# EAGLE design 01 (EAGLE 6.3)
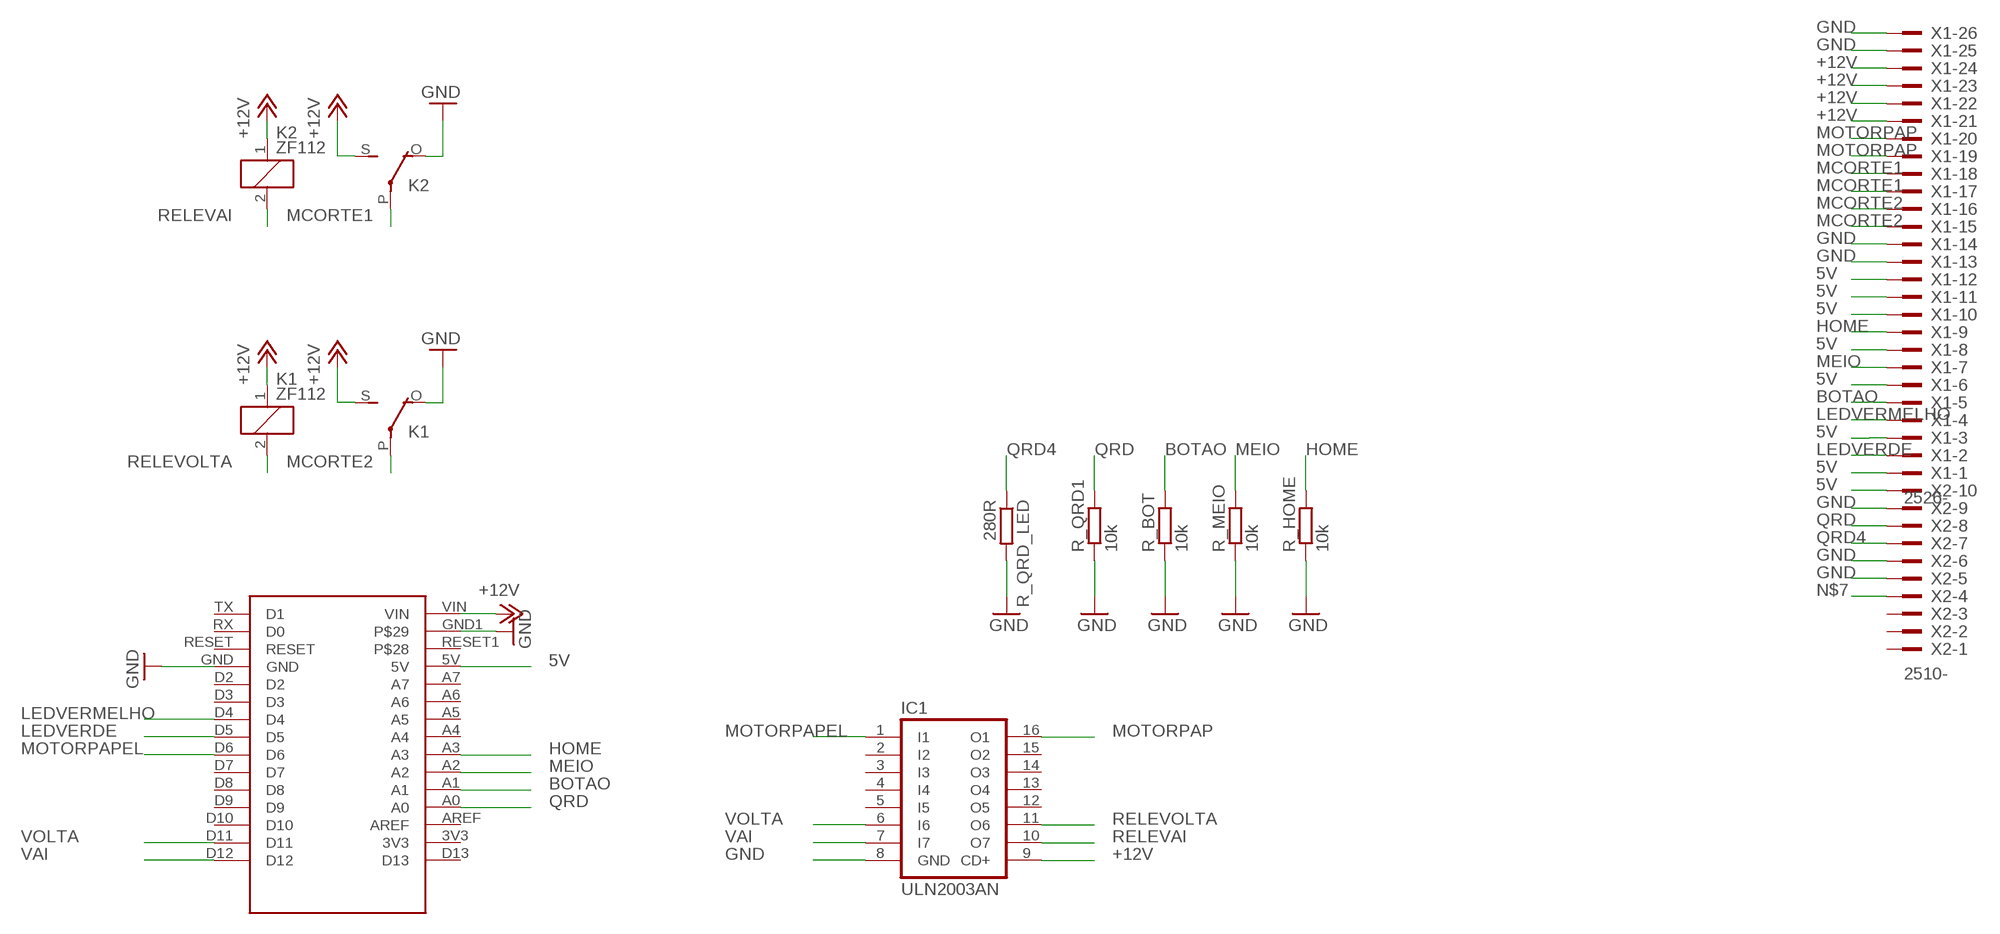
[diagram p0: schematic, sheet 1]

## Parts
IC1  ULN2003AN  [DIL16]
K1  ZF112  [ZF112]
K2  ZF112  [ZF112]
R_BOT  10k  R-EU_0207/15  [0207/15]
R_HOME  10k  R-EU_0207/15  [0207/15]
R_MEIO  10k  R-EU_0207/15  [0207/15]
R_QRD1  10k  R-EU_0207/15  [0207/15]
R_QRD_LED  280R  R-EU_0204/7  [0204/7]
U$1  ARDUINONANO  [NANO]
X1  2526-  [PAK100/2500-26]
X2  2510-  [PAK100/2500-10]

## Nets
5V: U$1.5V X1.1 X1.3 X1.6 X1.8 X1.10 X1.11 X1.12 X2.10
+12V: IC1.9(CD+) K1.1 K1.S(2:S) K2.1 K2.S(2:S) U$1.VIN X1.21 X1.22 X1.23 X1.24
BOTAO: R_BOT.2 U$1.A1 X1.5
GND: IC1.8(GND) K1.O(2:O) K2.O(2:O) R_BOT.1 R_HOME.1 R_MEIO.1 R_QRD1.1 R_QRD_LED.2 U$1.GND U$1.GND1 X1.13 X1.14 X1.25 X1.26 X2.5 X2.6 X2.9
HOME: R_HOME.2 U$1.A3 X1.9
LEDVERDE: U$1.D5 X1.2
LEDVERMELHO: U$1.D4 X1.4
MCORTE1: K2.P(2:P) X1.17 X1.18
MCORTE2: K1.P(2:P) X1.15 X1.16
MEIO: R_MEIO.2 U$1.A2 X1.7
MOTORPAP: IC1.16(O1) X1.19 X1.20
MOTORPAPEL: IC1.1(I1) U$1.D6
N$7: X2.4
QRD: R_QRD1.2 U$1.A0 X2.8
QRD4: R_QRD_LED.1 X2.7
RELEVAI: IC1.10(O7) K2.2
RELEVOLTA: IC1.11(O6) K1.2
VAI: IC1.7(I7) U$1.D12
VOLTA: IC1.6(I6) U$1.D11
Unconnected: IC1.2(I2) IC1.3(I3) IC1.4(I4) IC1.5(I5) IC1.12(O5) IC1.13(O4) IC1.14(O3) IC1.15(O2) U$1.3V3 U$1.A4 U$1.A5 U$1.A6 U$1.A7 U$1.AREF U$1.D2 U$1.D3 U$1.D7 U$1.D8 U$1.D9 U$1.D10 U$1.D13 U$1.RESET U$1.RESET1 U$1.RX(D0) U$1.TX(D1) X2.1 X2.2 X2.3

## Library data of the parts
IC1 = uln-udn:ULN2003A: DRIVER ARRAY
K1 K2 = relay:ZF112: RELAY 1 x switch; OC_FARNELL: unknown; OC_NEWARK: unknown
R_BOT R_HOME R_MEIO R_QRD1 R_QRD_LED = rcl:R-EU_: RESISTOR, European symbol
U$1 = arduino:ARDUINONANO
X1 = con-3m:2526-: 3M (TM) Pak 100 4-Wall Header Source: 3M; OC_FARNELL: unknown; OC_NEWARK: unknown
X2 = con-3m:2510-: 3M (TM) Pak 100 4-Wall Header Source: 3M; MF: 3M; MPN: 2510-6002UB; OC_FARNELL: 9838244; OC_NEWARK: 46F4725

## Board
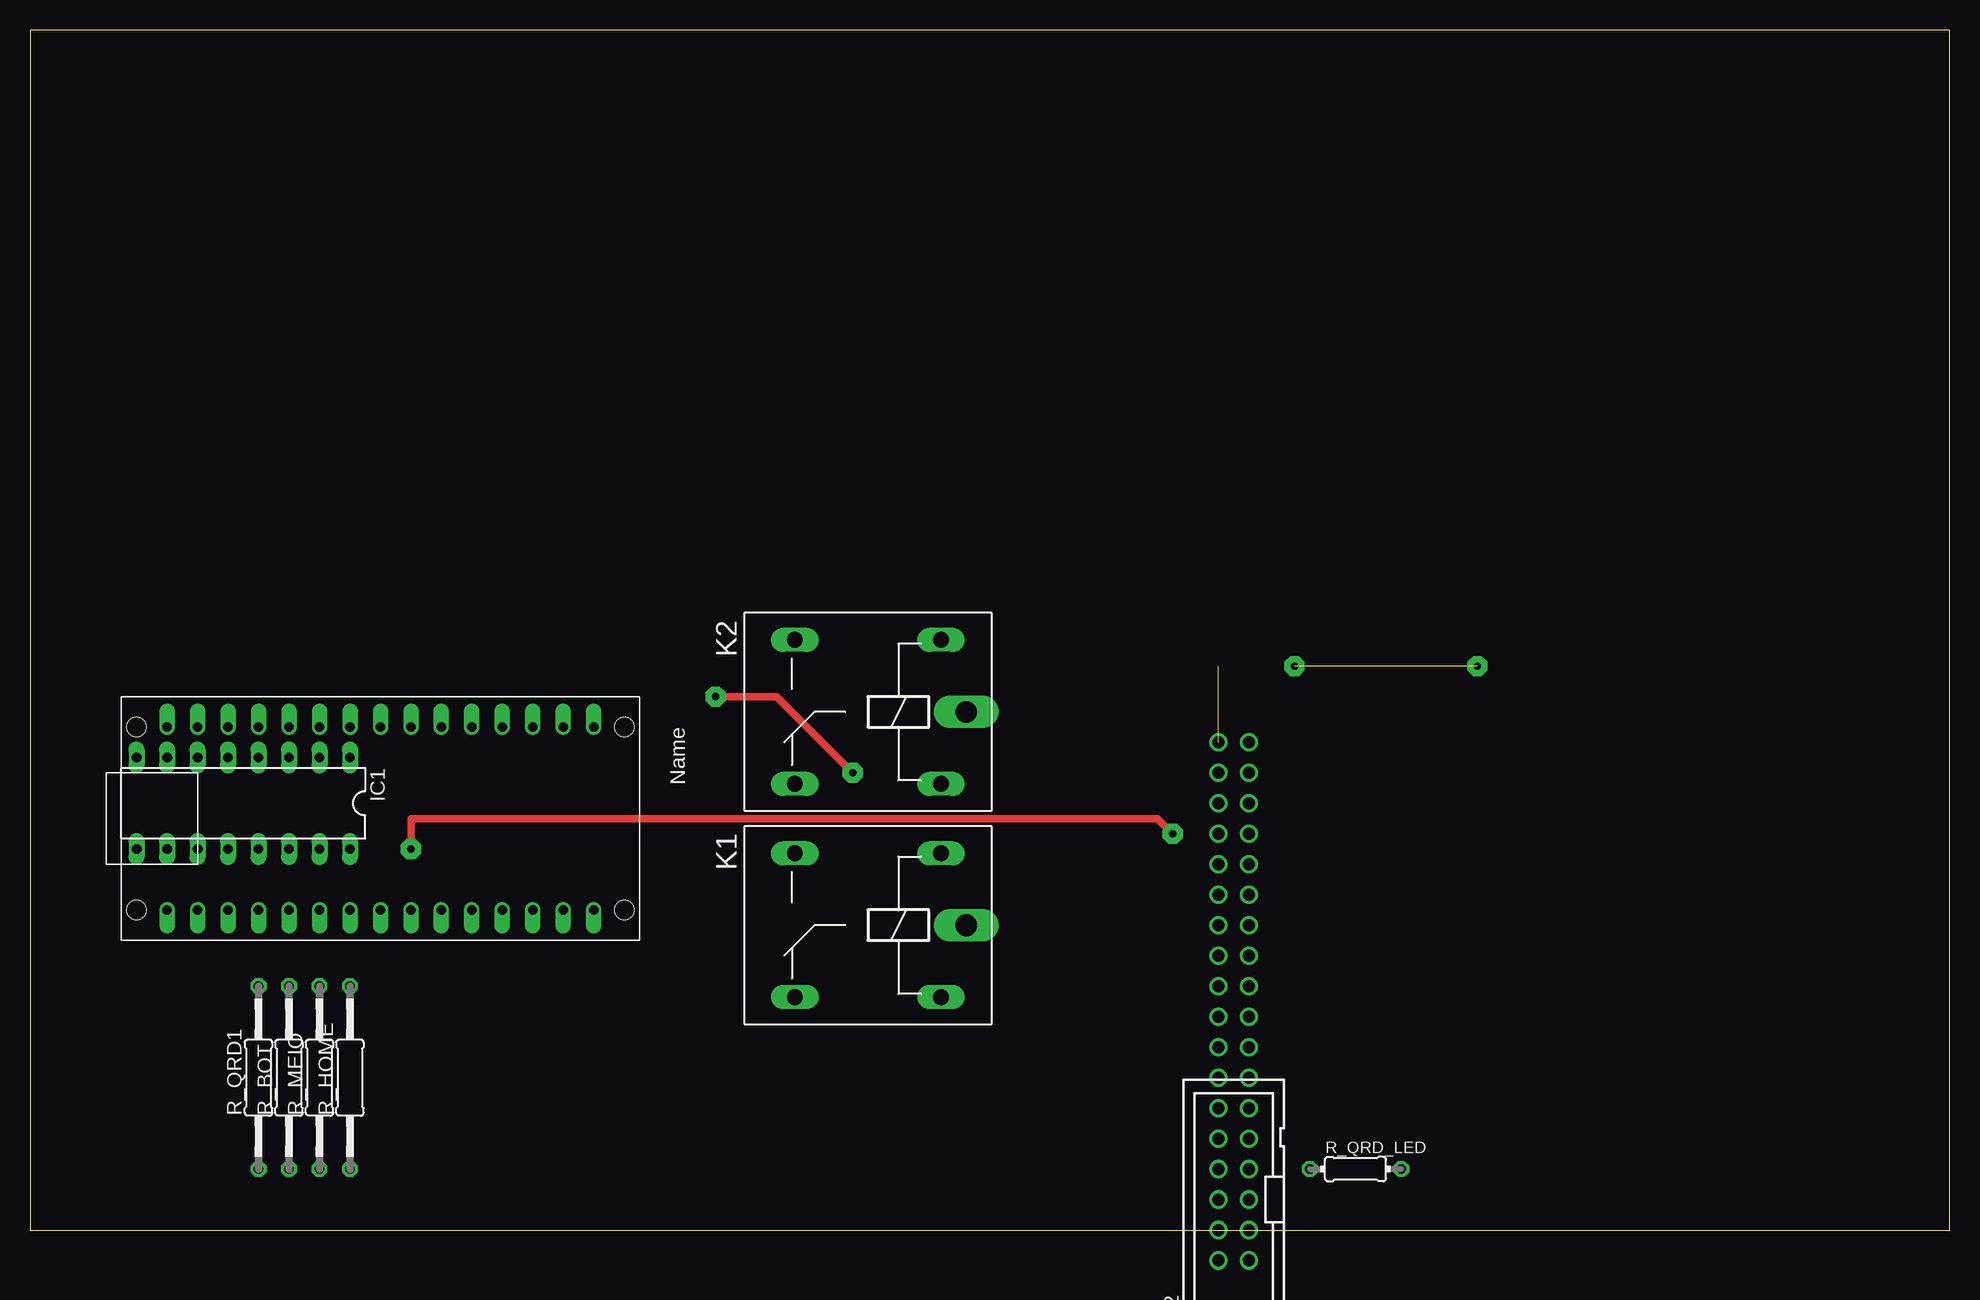
[diagram p1: board, top side]
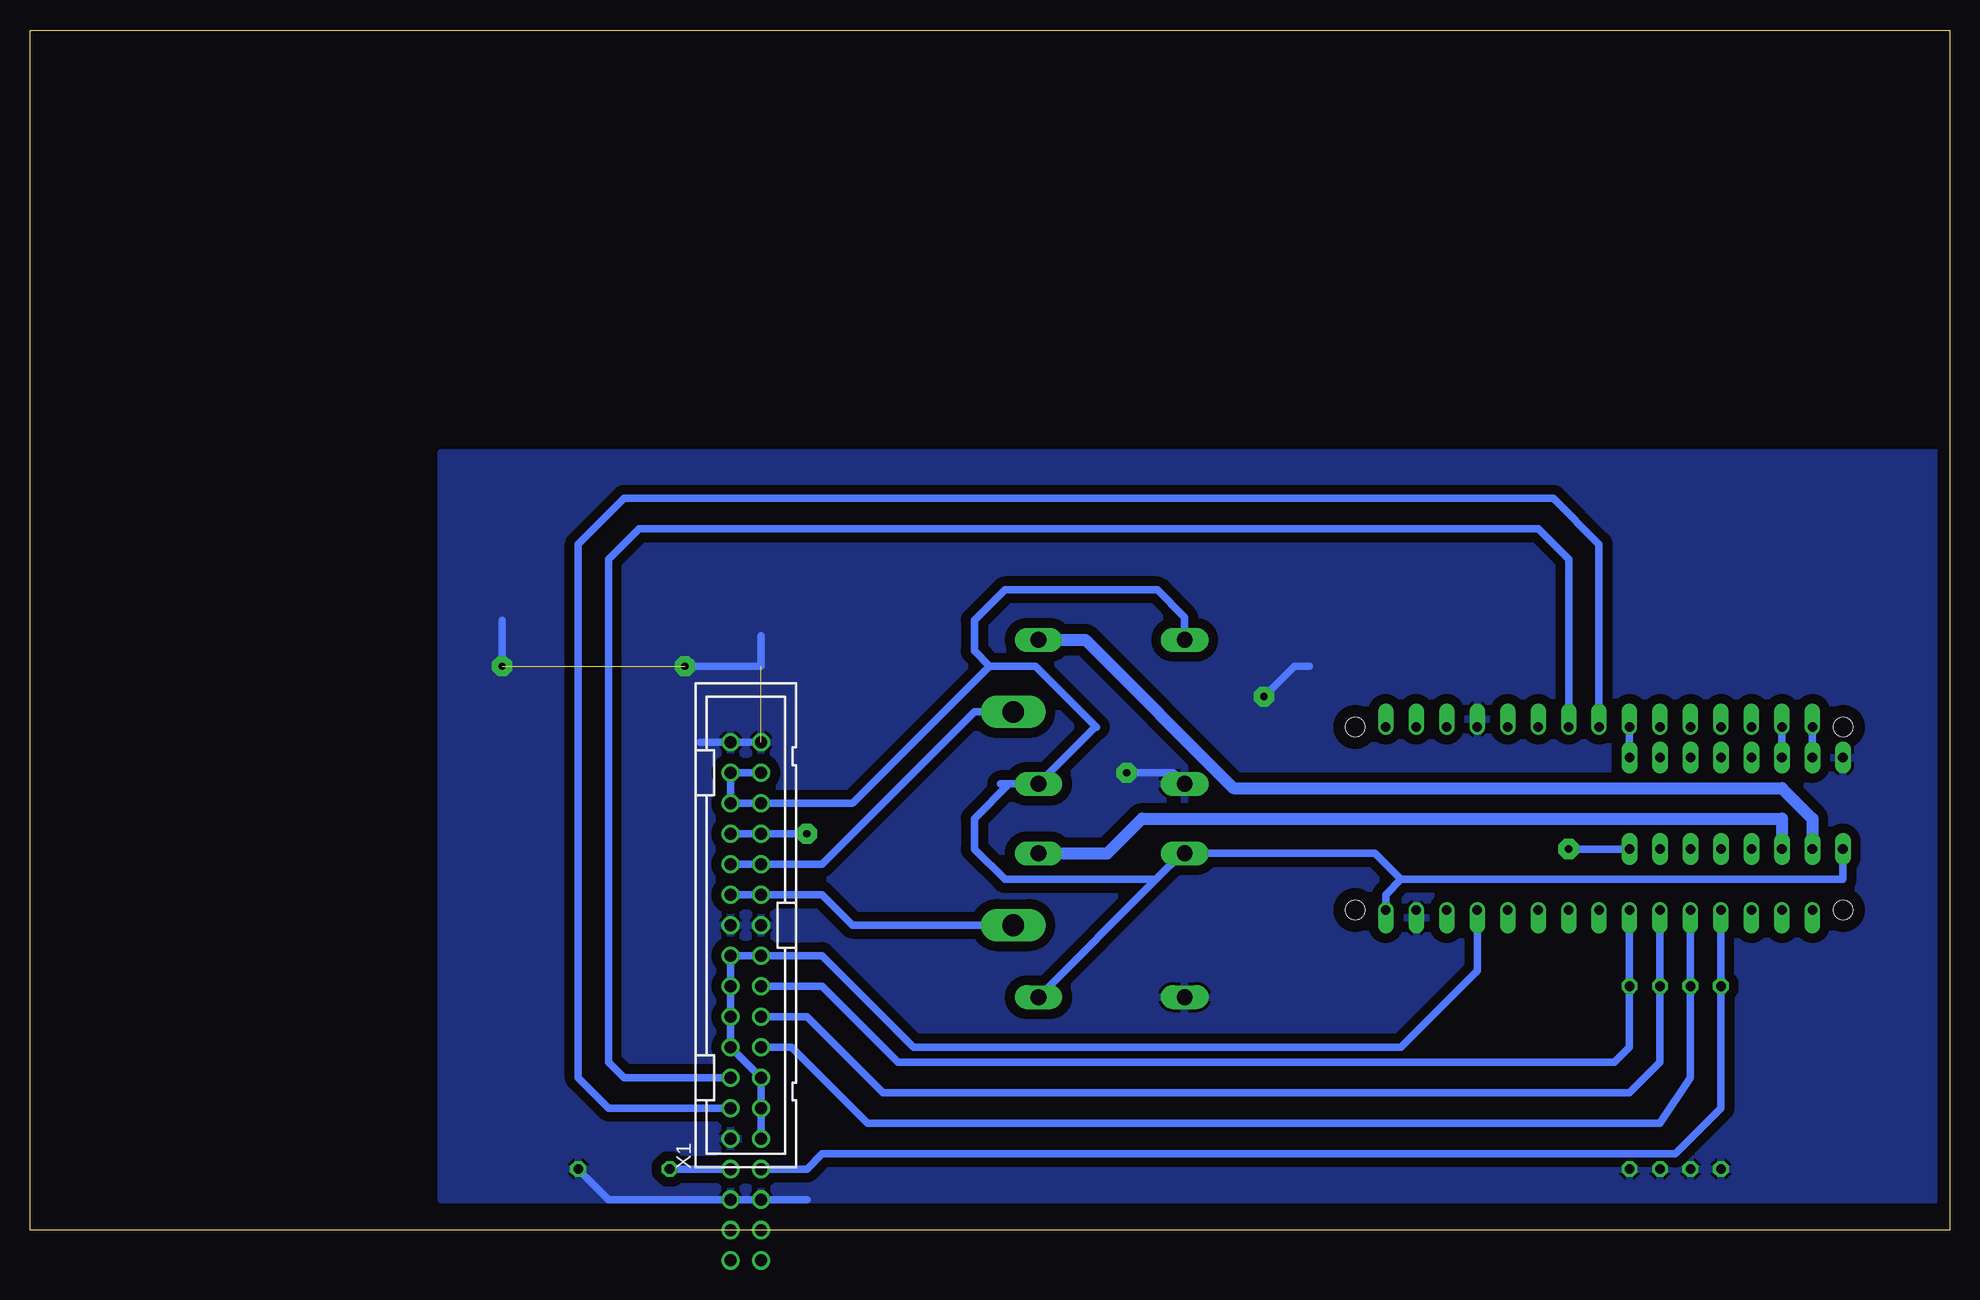
[diagram p2: board, bottom side, seen from below]

Size 160 x 100 mm. Coordinates in mm from the lower left corner, seen from the top.
Outline: 0,0 160,0 160,100 0,100 0,0
Copper layers (1*16): Top 0.035mm / dielectric 1.5mm / Bottom 0.035mm
Design rules "default": minimum track width 10mil, minimum drill 24mil, track to track 8mil, track to pad 8mil, pad to pad 8mil, via to via 8mil, smd to smd 8mil, copper to edge 40mil, drill to drill 8mil, minimum pad ring 10mil, minimum via ring 8mil, stop-mask expansion 4mil, vias tented up to drill 0mil, thermal gap 10mil

### Footprints (pad centres in the part's own frame; a part is rotated, then mirrored left to right if it is on the bottom)
DIL16 = drill 0.813 long: 1 -8.89,-3.81; 2 -6.35,-3.81; 3 -3.81,-3.81; 4 -1.27,-3.81; 5 1.27,-3.81; 6 3.81,-3.81; 7 6.35,-3.81; 8 8.89,-3.81; 9 8.89,3.81; 10 6.35,3.81; 11 3.81,3.81; 12 1.27,3.81; 13 -1.27,3.81; 14 -3.81,3.81; 15 -6.35,3.81; 16 -8.89,3.81
ZF112 = drill 1.321 long: 1 -6.096,5.994; 2 -6.096,-5.994; O 6.096,5.994; S 6.096,-5.994 | drill 1.803 long: P -8.204,0
0207/15 = drill 0.813 octagon: 1 -7.62,0; 2 7.62,0
0204/7 = drill 0.813 octagon: 1 -3.81,0; 2 3.81,0
NANO = drill 0.8 offset: 3V3 7.62,-13.97; 5V 7.62,11.43; A0 7.62,-8.89; A1 7.62,-6.35; A2 7.62,-3.81; A3 7.62,-1.27; A4 7.62,1.27; A5 7.62,3.81; A6 7.62,6.35; A7 7.62,8.89; AREF 7.62,-11.43; D2 -7.62,8.89; D3 -7.62,6.35; D4 -7.62,3.81; D5 -7.62,1.27; D6 -7.62,-1.27; D7 -7.62,-3.81; D8 -7.62,-6.35; D9 -7.62,-8.89; D10 -7.62,-11.43; D11 -7.62,-13.97; D12 -7.62,-16.51; D13 7.62,-16.51; GND -7.62,11.43; GND1 7.62,16.51; RESET -7.62,13.97; RESET1 7.62,13.97; RX -7.62,16.51; TX -7.62,19.05; VIN 7.62,19.05 | hole 1.6: -7.62,21.59; 7.62,21.59; 7.62,-19.05; -7.62,-19.05
PAK100/2500-26 = drill 1 pad 1.422: 1 -15.24,-1.27; 2 -15.24,1.27; 3 -12.7,-1.27; 4 -12.7,1.27; 5 -10.16,-1.27; 6 -10.16,1.27; 7 -7.62,-1.27; 8 -7.62,1.27; 9 -5.08,-1.27; 10 -5.08,1.27; 11 -2.54,-1.27; 12 -2.54,1.27; 13 0,-1.27; 14 0,1.27; 15 2.54,-1.27; 16 2.54,1.27; 17 5.08,-1.27; 18 5.08,1.27; 19 7.62,-1.27; 20 7.62,1.27; 21 10.16,-1.27; 22 10.16,1.27; 23 12.7,-1.27; 24 12.7,1.27; 25 15.24,-1.27; 26 15.24,1.27
PAK100/2500-10 = drill 1 pad 1.422: 1 -5.08,-1.27; 2 -5.08,1.27; 3 -2.54,-1.27; 4 -2.54,1.27; 5 0,-1.27; 6 0,1.27; 7 2.54,-1.27; 8 2.54,1.27; 9 5.08,-1.27; 10 5.08,1.27

### Placement (x,y rotation side)
IC1  17.78,35.56 180 top
K1  69.85,25.4 180 top
K2  69.85,43.18 180 top
R_BOT  21.59,12.7 90 top
R_HOME  26.67,12.7 90 top
R_MEIO  24.13,12.7 90 top
R_QRD1  19.05,12.7 90 top
R_QRD_LED  110.49,5.08 0 top
U$1  27.94,34.29 270 top
X1  100.33,25.4 90 bottom
X2  100.33,2.54 90 top

### Tracks (layer width: path | path; a pad name or v marks a point on that pad's centre or on a via)
5V
  Bottom 0.61: U$1.5V 39.37,21.59 45.72,15.24 86.36,15.24 93.98,22.86 X1.12 | X1.12 X1.10 X1.8 X1.6 X1.3 X1.1 X2.10 | X1.12 X1.11
+12V
  Bottom 0.61: IC1.9 8.89,29.21 45.72,29.21 | 45.72,29.21 46.99,27.94 U$1.VIN | 45.72,29.21 47.9,31.39 K1.S 63.96,31.39 66.14,29.21 | 66.14,29.21 K1.1 | 78.38,37.19 K2.1 71.22,41.91 71.12,41.91 76.2,46.99 80.01,46.99 | 78.38,37.19 81.28,34.29 81.28,31.75 78.74,29.21 66.14,29.21 | 78.38,37.19 79.1,37.19 | K2.S 63.75,51.05 66.04,53.34 78.74,53.34 81.28,50.8 81.28,48.26 80.01,46.99 | 80.01,46.99 91.44,35.56 X1.21 X1.22 X1.24 X1.23
BOTAO
  Bottom 0.61: X1.5 96.52,15.24 90.17,8.89 24.13,8.89 21.59,12.7 R_BOT.2 U$1.A1
GND  (via drill 0.6 pad 1.68)  (2 unrouted)
  Top 0.61: v68.58,38.1 62.23,44.45 v57.15,44.45
  Bottom 0.61: K2.O 64.67,38.1 v68.58,38.1 | v57.15,44.45 54.61,46.99 53.34,46.99 | X1.25 X1.26 104.14,40.64 | R_QRD_LED.2 111.76,2.54 X2.5 95.25,2.54 | 120.65,50.8 v120.65,46.99 | v105.41,46.99 99.06,46.99 99.06,49.53
  pour Bottom (isolate 0.813): -2.54,64.77 125.73,64.77 125.73,2.54 -2.54,2.54
HOME
  Bottom 0.61: X1.9 93.98,20.32 87.63,13.97 27.94,13.97 26.67,15.24 R_HOME.2 U$1.A3
LEDVERDE
  Bottom 0.61: X1.2 111.76,10.16 114.3,12.7 114.3,57.15 110.49,60.96 33.02,60.96 29.21,57.15 U$1.D5
LEDVERMELHO
  Bottom 0.61: X1.4 110.49,12.7 111.76,13.97 111.76,55.88 109.22,58.42 34.29,58.42 31.75,55.88 U$1.D4
MCORTE1
  Bottom 0.61: X1.18 X1.17 93.98,30.48 81.28,43.18 K2.P
MCORTE2
  Bottom 0.61: X1.16 X1.15 93.98,27.94 91.44,25.4 K1.P
MEIO
  Bottom 0.61: X1.7 95.25,17.78 88.9,11.43 26.67,11.43 24.13,13.97 R_MEIO.2 U$1.A2
MOTORPAP  (via drill 0.6 pad 1.68)
  Top 0.61: v95.25,33.02 93.98,34.29 31.75,34.29 v31.75,31.75
  Bottom 0.61: X1.20 X1.19 v95.25,33.02 | v31.75,31.75 IC1.16
MOTORPAPEL
  Bottom 0.61: IC1.1 U$1.D6
QRD
  Bottom 0.61: U$1.A0 R_QRD1.2 19.05,10.16 22.86,6.35 93.98,6.35 95.25,5.08 X2.8
QRD4
  Bottom 0.61: R_QRD_LED.1 X2.7
RELEVAI
  Bottom 1.016: K2.2 72.03,49.17 59.69,36.83 13.97,36.83 11.43,34.29 IC1.10
RELEVOLTA
  Bottom 1.016: K1.2 70.21,31.39 67.31,34.29 13.97,34.29 IC1.11
VAI
  Bottom 0.61: IC1.7 U$1.D12
VOLTA
  Bottom 0.61: IC1.6 U$1.D11